# Altium schematic sheet Esquematico.SchDoc
size A
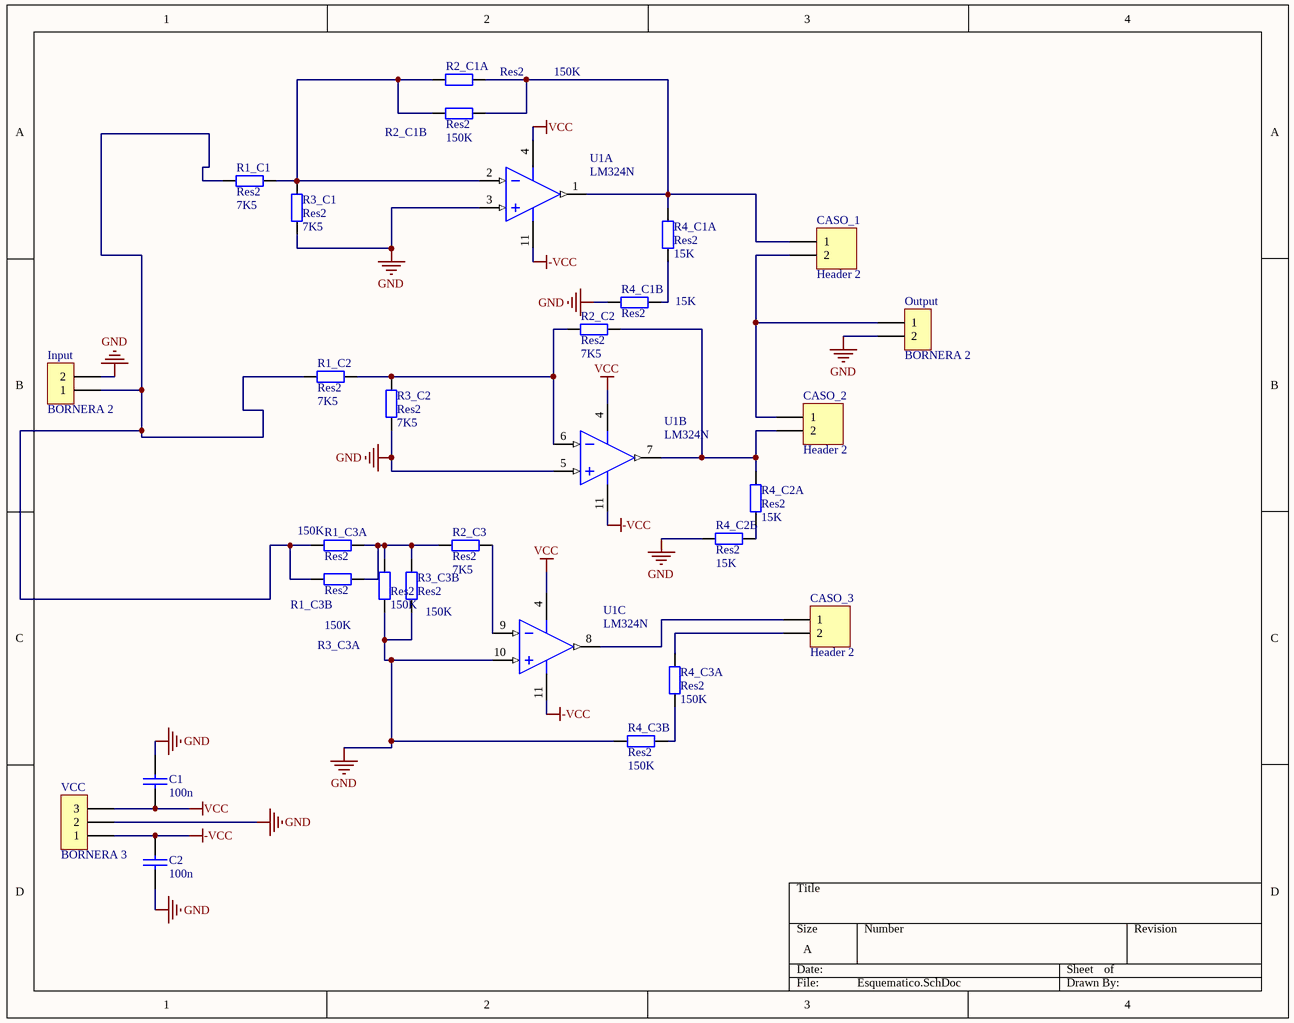
[diagram p0: Esquematico.SchDoc]

## Parts
C1  100n  [CAP100]
C2  100n  [CAP100]
CASO_1  Header 2  [HDR1X2]
CASO_2  Header 2  [HDR1X2]
CASO_3  Header 2  [HDR1X2]
Input  BORNERA 2  [BORNERA2]
Output  BORNERA 2  [BORNERA2]
R1_C1  Res2  value 7K5  [AXIAL-0.4]
R1_C2  Res2  value 7K5  [AXIAL-0.4]
R1_C3A  Res2  value 150K  [AXIAL-0.4]
R1_C3B  Res2  value 150K  [AXIAL-0.4]
R2_C1A  Res2  value 150K  [AXIAL-0.4]
R2_C1B  Res2  value 150K  [AXIAL-0.4]
R2_C2  Res2  value 7K5  [AXIAL-0.4]
R2_C3  Res2  value 7K5  [AXIAL-0.4]
R3_C1  Res2  value 7K5  [AXIAL-0.4]
R3_C2  Res2  value 7K5  [AXIAL-0.4]
R3_C3A  Res2  value 150K  [AXIAL-0.4]
R3_C3B  Res2  value 150K  [AXIAL-0.4]
R4_C1A  Res2  value 15K  [AXIAL-0.4]
R4_C1B  Res2  value 15K  [AXIAL-0.4]
R4_C2A  Res2  value 15K  [AXIAL-0.4]
R4_C2B  Res2  value 15K  [AXIAL-0.4]
R4_C3A  Res2  value 150K  [AXIAL-0.4]
R4_C3B  Res2  value 150K  [AXIAL-0.4]
U1  LM324N  [N14A]  (parts A,B,C of 4)
VCC  BORNERA 3  [BORNERA3]

## Nets
-VCC: C2.1 U1.11(GND) VCC.1
GND: C1.1 C2.2 Input.2 Output.2 R3_C1.1 R3_C2.1 R3_C3A.1 R3_C3B.1 R4_C1B.1 R4_C2B.1 R4_C3B.1 U1.3(IN1+) U1.5(IN2+) U1.10(IN3+) VCC.2
VCC: C1.2 U1.4(V+) VCC.3
NetCASO_1_1: CASO_1.1 R2_C1A.1 R2_C1B.1 R4_C1A.1 U1.1(OUT1)
NetCASO_1_2: CASO_1.2 CASO_2.1 Output.1
NetCASO_2_2: CASO_2.2 R2_C2.1 R4_C2A.2 U1.7(OUT2)
NetCASO_3_1: CASO_3.1 U1.8(OUT3)
NetCASO_3_2: CASO_3.2 R4_C3A.1
NetInput_1: Input.1 R1_C1.1 R1_C2.1 R1_C3A.1 R1_C3B.1
NetR1_C1_2: R1_C1.2 R2_C1A.2 R2_C1B.2 R3_C1.2 U1.2(IN1-)
NetR1_C2_2: R1_C2.2 R2_C2.2 R3_C2.2 U1.6(IN2-)
NetR1_C3A_2: R1_C3A.2 R1_C3B.2 R2_C3.2 R3_C3A.2 R3_C3B.2
NetR2_C3_1: R2_C3.1 U1.9(IN3-)
NetR4_C1A_2: R4_C1A.2 R4_C1B.2
NetR4_C2A_1: R4_C2A.1 R4_C2B.2
NetR4_C3A_2: R4_C3A.2 R4_C3B.2

## Library data of the parts
C1 C2 = CAP
CASO_1-CASO_3 = Header 2: Header, 2-Pin; LatestRevisionDate: 17-Jul-2002; LatestRevisionNote: Re-released for DXP Platform.; Publisher: Altium Limited
R1_C1 R1_C2 R1_C3A R1_C3B R2_C1A R2_C1B R2_C2 R2_C3 R3_C1 R3_C2 R3_C3A R3_C3B R4_C1A R4_C1B R4_C2A R4_C2B R4_C3A R4_C3B = Res2: Resistor; Published: 8-Jun-2000; LatestRevisionDate: 17-Jul-2002; LatestRevisionNote: Re-released for DXP Platform.; PackageReference: AXIAL-0.4; Publisher: Altium Limited; PackageDescription: Axial Device, Thru-Hole; 2 Leads; 0.4 in Pin Spacing
U1 = LM324N: Low Power Quad Operational Amplifier, 14-pin MDIP; Manufacturer: National Semiconductor; PackageTopMarking: NSUZXYYTTE#*LM324N; PowerWise: N; CompType: Amplifiers; Published: 4-Dec-2008; LatestRevisionDate: 13-Jan-2009; LatestRevisionNote: Sim Model Added.; DatasheetVersion: Aug-2000; PackageVersion: revG, May-2006; PackageReference: N14A; Publisher: Altium Limited; PackageDescription: MDIP, .750 x .250 x.130in, 14 Lead, .100in Pitch; PartNumber: LM324N; RoHS: N; PinCount: 14; Code_JEDEC: MS-001-AA; ComponentLink1Description: LM324 Datasheet; ComponentLink1URL: http://www.national.com/ds/LM/LM324.pdf; ComponentLink2Description: LM324 Web Page; ComponentLink2URL: http://www.national.com/pf/LM/LM324.html; ComponentLink3Description: N14A Package Page; ComponentLink3URL: http://www.national.com/packaging/folders/n14a.html